# EAGLE schematic v1-landshark-handheld-controller (EAGLE 6.6.0)
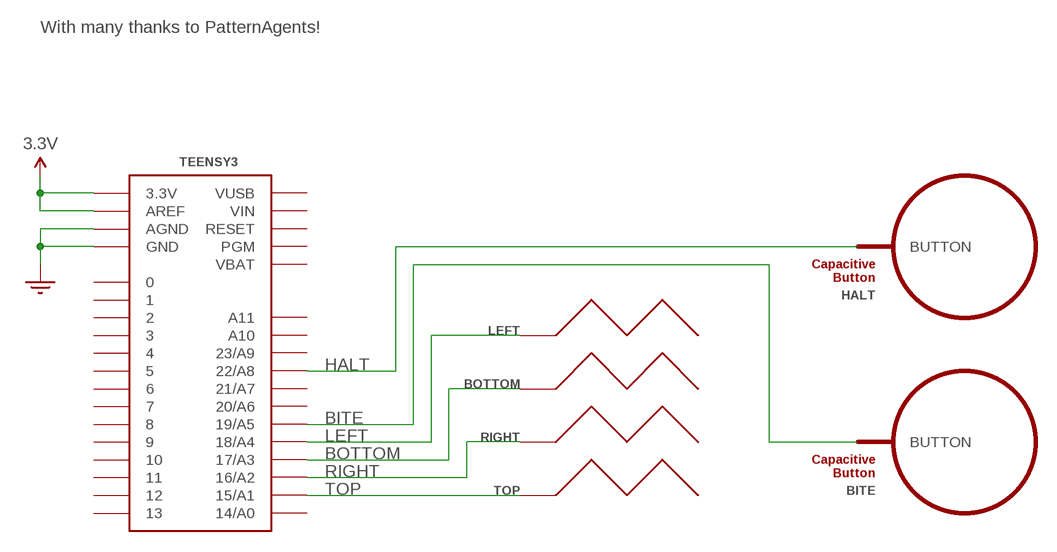
[diagram p0: schematic, sheet 1]

## Parts
BITE  BUTTON_PASSIVE12MM  [BUTTON_PASSIVE_12MM]
BOTTOM  SLIDER_PASSIVE_1SEG  [SLIDER_PASSIVE_1SEG_12MM]
HALT  BUTTON_PASSIVE12MM  [BUTTON_PASSIVE_12MM]
LEFT  SLIDER_PASSIVE_1SEG  [SLIDER_PASSIVE_1SEG_12MM]
RIGHT  SLIDER_PASSIVE_1SEG  [SLIDER_PASSIVE_1SEG_12MM]
TEENSY3  TEENSY_3.0+4  [TEENSY_3.0+4]
TOP  SLIDER_PASSIVE_1SEG  [SLIDER_PASSIVE_1SEG_12MM]

## Nets
3.3V: TEENSY3.3.3V TEENSY3.3.3V1(3.3V) TEENSY3.AREF
BITE: BITE.BUTTON TEENSY3.19/A5
BOTTOM: BOTTOM.P$1(SL1) TEENSY3.17/A3
GND: TEENSY3.AGND TEENSY3.GND TEENSY3.GND1(GND)
HALT: HALT.BUTTON TEENSY3.22/A8
LEFT: LEFT.P$1(SL1) TEENSY3.18/A4
RIGHT: RIGHT.P$1(SL1) TEENSY3.16/A2
TOP: TEENSY3.15/A1 TOP.P$1(SL1)
Unconnected: TEENSY3.0 TEENSY3.1 TEENSY3.2 TEENSY3.3 TEENSY3.4 TEENSY3.5 TEENSY3.6 TEENSY3.7 TEENSY3.8 TEENSY3.9 TEENSY3.10 TEENSY3.11 TEENSY3.12 TEENSY3.13 TEENSY3.14/A0 TEENSY3.20/A6 TEENSY3.21/A7 TEENSY3.23/A9 TEENSY3.A10 TEENSY3.A11 TEENSY3.PGM TEENSY3.RESET

## Notes on the sheet
- With many thanks to PatternAgents!

## Power pins joined to a net without a drawn wire
VBAT: TEENSY3.VBAT
VIN: TEENSY3.VIN
VUSB: TEENSY3.VUSB

## Library data of the parts
BITE HALT = PatternAgents-TouchWidgets:BUTTON_PASSIVE: Button, Passive Capacitive/Touch Sensing Type Source : http://www.PatternAgents.com Github : https://github.com/PatternAgents License : http://creativecommons.org/licenses/by-sa/3.1/ (Creative Commons 3.1) THIS SOFTWARE IS PROVIDED BY THE CONTRIBUTORS "AS IS" AND WITHOUT ANY EXPRESS OR IMPLIED WARRANTIES, INCLUDING, BUT NOT LIMITED TO, THE IMPLIED WARRANTIES OF MERCHANTABILITY AND FITNESS FOR A PARTICULAR PURPOSE ARE DISCLAIMED. IN NO EVENT SHALL THE COPYRIGHT OWNER OR CONTRIBUTORS BE LIABLE FOR ANY DIRECT, INDIRECT, INCIDENTAL, SPECIAL, EXEMPLARY, OR CONSEQUENTIAL DAMAGES (INCLUDING, BUT NOT LIMITED TO, PROCUREMENT OF SUBSTITUTE GOODS OR SERVICES; LOSS OF USE, DATA, OR PROFITS; OR BUSINESS INTERRUPTION) HOWEVER CAUSED AND ON ANY THEORY OF LIABILITY, WHETHER IN CONTRACT, STRICT LIABILITY, OR TORT (INCLUDING NEGLIGENCE OR OTHERWISE) ARISING IN ANY WAY OUT OF THE USE OF THIS SOFTWARE, EVEN IF ADVISED OF THE POSSIBILITY OF SUCH DAMAGE.
BOTTOM LEFT RIGHT TOP = PatternAgents-TouchWidgets:SLIDER_PASSIVE_1SEG: Slider, Passive Touch/Capacitive Sensing Type, One (1) Segment Source : http://www.PatternAgents.com Github : https://github.com/PatternAgents License : http://creativecommons.org/licenses/by-sa/3.1/ (Creative Commons 3.1) THIS SOFTWARE IS PROVIDED BY THE CONTRIBUTORS "AS IS" AND WITHOUT ANY EXPRESS OR IMPLIED WARRANTIES, INCLUDING, BUT NOT LIMITED TO, THE IMPLIED WARRANTIES OF MERCHANTABILITY AND FITNESS FOR A PARTICULAR PURPOSE ARE DISCLAIMED. IN NO EVENT SHALL THE COPYRIGHT OWNER OR CONTRIBUTORS BE LIABLE FOR ANY DIRECT, INDIRECT, INCIDENTAL, SPECIAL, EXEMPLARY, OR CONSEQUENTIAL DAMAGES (INCLUDING, BUT NOT LIMITED TO, PROCUREMENT OF SUBSTITUTE GOODS OR SERVICES; LOSS OF USE, DATA, OR PROFITS; OR BUSINESS INTERRUPTION) HOWEVER CAUSED AND ON ANY THEORY OF LIABILITY, WHETHER IN CONTRACT, STRICT LIABILITY, OR TORT (INCLUDING NEGLIGENCE OR OTHERWISE) ARISING IN ANY WAY OUT OF THE USE OF THIS SOFTWARE, EVEN IF ADVISED OF THE POSSIBILITY OF SUCH DAMAGE.
TEENSY3 = Teensy3.0:TEENSY_3.0+4: Teensy 3.0 board, showing all pins that are easily acessible. See 'AllAnalogPins" and 'AllPins' packages for additional pin holes, as needed. The 'Basic' package has fewer pins.